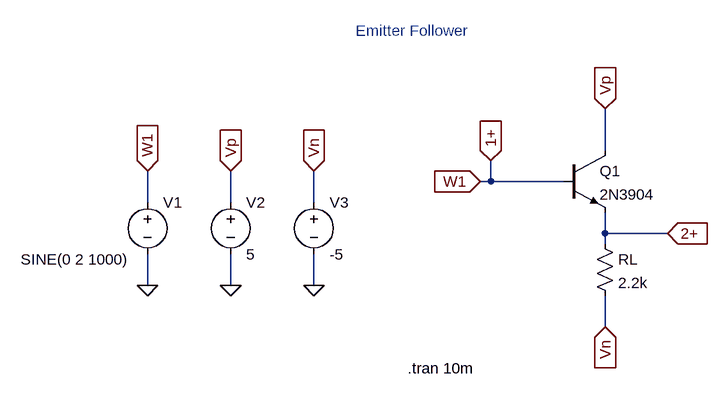
[diagram p0: schematic emit_flw.asc]
emit_flw.asc, the LTspice schematic file:
Version 4
SHEET 1 880 680
WIRE 112 0 112 -64
WIRE -64 48 -64 16
WIRE -64 48 -80 48
WIRE 48 48 -64 48
WIRE -592 80 -592 32
WIRE -464 80 -464 32
WIRE -336 80 -336 32
WIRE 112 128 112 96
WIRE 208 128 112 128
WIRE 112 144 112 128
WIRE -592 208 -592 160
WIRE -464 208 -464 160
WIRE -336 208 -336 160
WIRE 112 272 112 224
FLAG -80 48 W1
IOPIN -80 48 In
FLAG 112 -64 Vp
IOPIN 112 -64 In
FLAG 112 272 Vn
IOPIN 112 272 In
FLAG -592 208 0
FLAG -464 208 0
FLAG -336 208 0
FLAG -592 32 W1
IOPIN -592 32 In
FLAG -464 32 Vp
IOPIN -464 32 In
FLAG -336 32 Vn
IOPIN -336 32 In
FLAG -64 16 1+
IOPIN -64 16 In
FLAG 208 128 2+
IOPIN 208 128 In
SYMBOL npn 48 0 R0
SYMATTR InstName Q1
SYMATTR Value 2N3904
SYMBOL res 96 128 R0
SYMATTR InstName RL
SYMATTR Value 2.2k
SYMBOL voltage -592 64 R0
WINDOW 3 -195 104 Left 2
WINDOW 123 0 0 Left 0
WINDOW 39 0 0 Left 0
SYMATTR Value SINE(0 2 1000)
SYMATTR InstName V1
SYMBOL voltage -464 64 R0
WINDOW 123 0 0 Left 0
WINDOW 39 0 0 Left 0
SYMATTR InstName V2
SYMATTR Value 5
SYMBOL voltage -336 64 R0
WINDOW 123 0 0 Left 0
WINDOW 39 0 0 Left 0
SYMATTR InstName V3
SYMATTR Value -5
TEXT -192 336 Left 2 !.tran 10m
TEXT -272 -184 Left 2 ;Emitter Follower

The netlist it stands for:
* emit_flw.asc
Q1 Vp 1+ 2+ 0 2N3904
RL 2+ Vn 2.2k
V1 1+ 0 SINE(0 2 1000)
V2 Vp 0 5
V3 Vn 0 -5
.model NPN NPN
.model PNP PNP
.lib standard.bjt
.tran 10m
* Emitter Follower
.backanno
.end